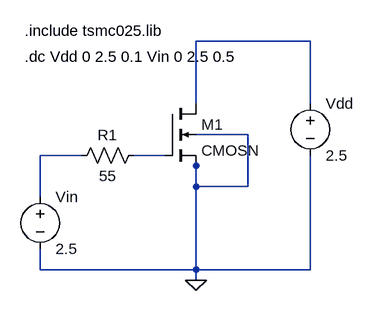
[diagram p0: schematic nmos_char.asc]
nmos_char.asc, the LTspice schematic file:
Version 4
SHEET 1 880 680
WIRE 384 16 208 16
WIRE 208 112 208 16
WIRE 384 112 384 16
WIRE 288 160 208 160
WIRE 32 192 -32 192
WIRE 160 192 112 192
WIRE 208 208 208 192
WIRE 208 240 208 208
WIRE 288 240 288 160
WIRE 288 240 208 240
WIRE -32 256 -32 192
WIRE -32 368 -32 336
WIRE 208 368 208 240
WIRE 208 368 -32 368
WIRE 384 368 384 192
WIRE 384 368 208 368
WIRE 208 384 208 368
FLAG 208 384 0
SYMBOL voltage 384 96 R0
WINDOW 123 0 0 Left 2
WINDOW 39 0 0 Left 2
SYMATTR InstName Vdd
SYMATTR Value 2.5
SYMBOL voltage -32 240 R0
WINDOW 123 0 0 Left 2
WINDOW 39 0 0 Left 2
SYMATTR InstName Vin
SYMATTR Value 2.5
SYMBOL res 128 176 R90
WINDOW 0 0 56 VBottom 2
WINDOW 3 32 56 VTop 2
SYMATTR InstName R1
SYMATTR Value 55
SYMBOL cmosn 160 112 R0
SYMATTR InstName M1
SYMATTR Value2 l=1.2u w=1.5u
TEXT -56 0 Left 2 !.include tsmc025.lib
TEXT -56 40 Left 2 !.dc Vdd 0 2.5 0.1 Vin 0 2.5 0.5

The netlist it stands for:
* nmos_char.asc
Vdd N001 0 2.5
Vin N002 0 2.5
R1 N003 N002 55
M1 N001 N003 0 0 CMOSN l=1.2u w=1.5u
.model NMOS NMOS
.model PMOS PMOS
.lib standard.mos
.include tsmc025.lib
.dc Vdd 0 2.5 0.1 Vin 0 2.5 0.5
.backanno
.end